# EAGLE design main (EAGLE 9.0.1)
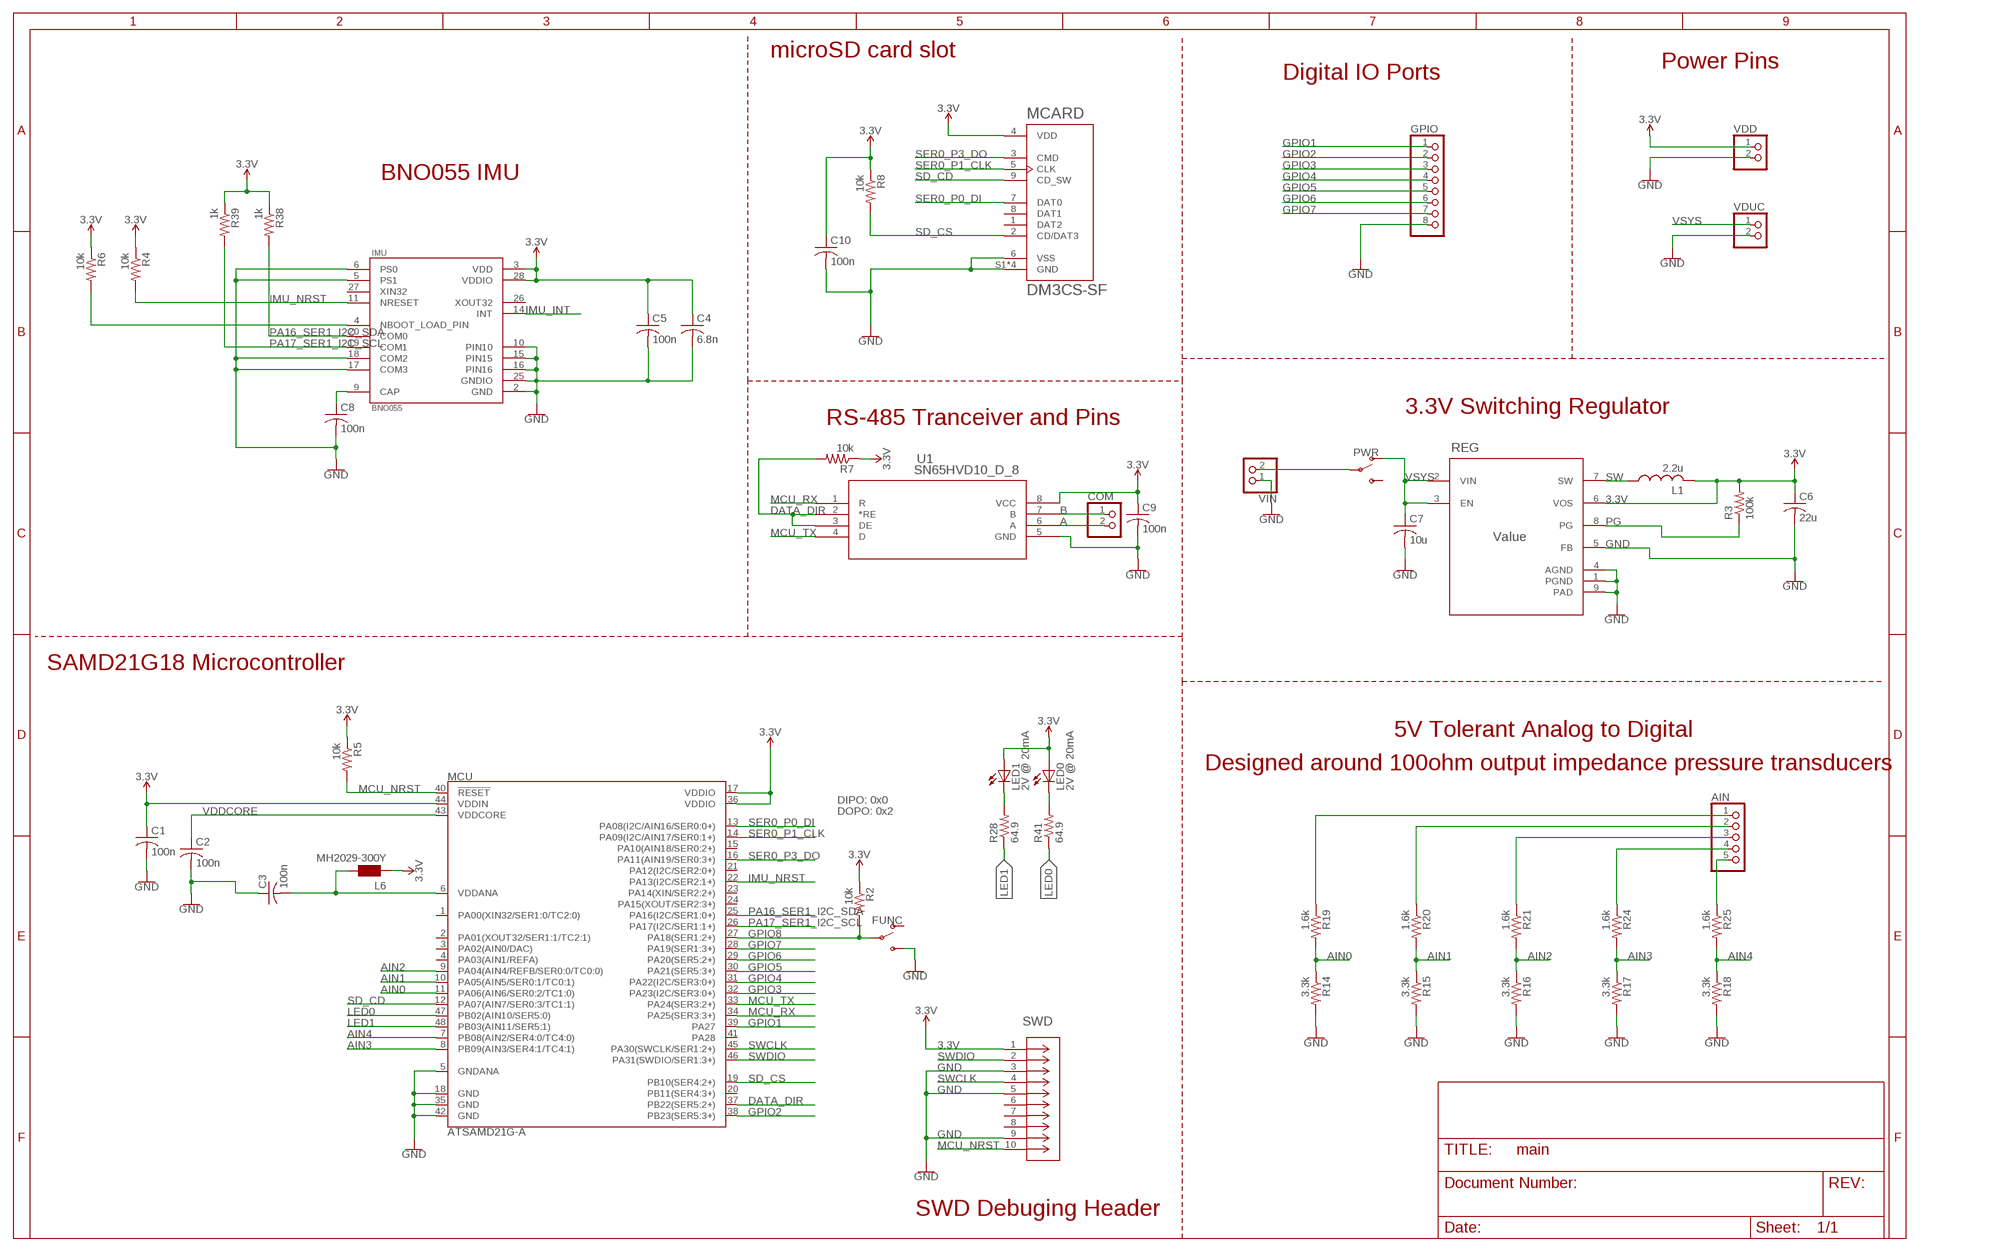
[diagram p0: schematic, sheet 1]

## Parts
AIN  PINHD-1X5  [1X05]
C1  100n  C-USC0603  [C0603]
C2  100n  C-USC0603  [C0603]
C3  100n  C-USC0603  [C0603]
C4  6.8n  C-USC0603  [C0603]
C5  100n  C-USC0603  [C0603]
C6  22u  C-USC0603  [C0603]
C7  10u  C-USC0603  [C0603]
C8  100n  C-USC0603  [C0603]
C9  100n  C-USC0603  [C0603]
C10  100n  C-USC0603  [C0603]
COM  PINHD-1X2  [1X02]
FUNC  SWITCH-SPDT-SMD-AYZ0202  [SWITCH_DPDT_SMD_AYZ0202]
GPIO  PINHD-1X8  [1X08]
IMU  BNO055  [LGA28R50P4X10_380X520X100]
L1  2.2u  L-USL2012C  [L2012C]
L6  MH2029-300Y  0001_BLM21PG300SN1D_/_MH2029-300Y  [0805]
LED0  2V @ 20mA  LEDCHIPLED_0603  [CHIPLED_0603]
LED1  2V @ 20mA  LEDCHIPLED_0603  [CHIPLED_0603]
MCARD  DM3CS-SF  [HRS_DM3CS-SF]
MCU  ATSAMD21G-A  [TQFP-48]
PWR  SWITCH-SPDT-PTH-11.6X4.0MM  [SWITCH_SPDT_PTH_11.6X4.0MM]
R2  10k  R-US_R0603  [R0603]
R3  100k  R-US_R0603  [R0603]
R4  10k  R-US_R0603  [R0603]
R5  10k  R-US_R0603  [R0603]
R6  10k  R-US_R0603  [R0603]
R7  10k  R-US_R0603  [R0603]
R8  10k  R-US_R0603  [R0603]
R14  3.3k  R-US_R0603  [R0603]
R15  3.3k  R-US_R0603  [R0603]
R16  3.3k  R-US_R0603  [R0603]
R17  3.3k  R-US_R0603  [R0603]
R18  3.3k  R-US_R0603  [R0603]
R19  1.6k  R-US_R0603  [R0603]
R20  1.6k  R-US_R0603  [R0603]
R21  1.6k  R-US_R0603  [R0603]
R24  1.6k  R-US_R0603  [R0603]
R25  1.6k  R-US_R0603  [R0603]
R28  64.9  R-US_R0603  [R0603]
R38  1k  R-US_R0603  [R0603]
R39  1k  R-US_R0603  [R0603]
R41  64.9  R-US_R0603  [R0603]
REG  Value  TPS62162QDSGRQ1  [DSG0008A]
SWD  DEBUG-HEADER  [CONN_MINITEK_2X5_HDR]
U1  SN65HVD10_D_8  [D8]
VDD  PINHD-1X2  [1X02]
VDUC  PINHD-1X2  [1X02]
VIN  PINHD-1X2  [1X02]

## Nets
3.3V: C1.1 C4.1 C5.1 C6.1 C9.1 C10.1 IMU.3(VDD) IMU.28(VDDIO) L1.2 L6.1 LED0.A LED1.A MCARD.4(VDD) MCU.17(VDDIO) MCU.36(VDDIO) MCU.44(VDDIN) R2.1 R3.2 R4.1 R5.1 R6.1 R7.1 R8.1 R38.1 R39.1 REG.6(VOS) SWD.1 U1.8(VCC) VDD.1
A: COM.2 U1.6(A)
AIN0: MCU.11(PA06(AIN6/SER0:2/TC1:0)) R14.1 R19.2
AIN1: MCU.10(PA05(AIN5/SER0:1/TC0:1)) R15.1 R20.2
AIN2: MCU.9(PA04(AIN4/REFB/SER0:0/TC0:0)) R16.1 R21.2
AIN3: MCU.8(PB09(AIN3/SER4:1/TC4:1)) R17.1 R24.2
AIN4: MCU.7(PB08(AIN2/SER4:0/TC4:0)) R18.1 R25.2
B: COM.1 U1.7(B)
DATA_DIR: MCU.37(PB22(SER5:2+)) R7.2 U1.2(*RE) U1.3(DE)
GND: C1.2 C2.2 C3.1 C4.2 C5.2 C6.2 C7.2 C8.2 C9.2 C10.2 FUNC.3(S) GPIO.8 IMU.2(GND) IMU.5(PS1) IMU.6(PS0) IMU.10(PIN10) IMU.15(PIN15) IMU.16(PIN16) IMU.17(COM3) IMU.18(COM2) IMU.25(GNDIO) MCARD.6(VSS) MCARD.S1(GND) MCARD.S2(GND) MCARD.S3(GND) MCARD.S5(GND) MCU.5(GNDANA) MCU.18(GND) MCU.35(GND) MCU.42(GND) R14.2 R15.2 R16.2 R17.2 R18.2 REG.1(PGND) REG.4(AGND) REG.5(FB) REG.9(PAD) SWD.3 SWD.5 SWD.9 U1.5(GND) VDD.2 VDUC.2 VIN.1
GPIO1: GPIO.1 MCU.39(PA27)
GPIO2: GPIO.2 MCU.38(PB23(SER5:3+))
GPIO3: GPIO.3 MCU.32(PA23(I2C/SER3:0+))
GPIO4: GPIO.4 MCU.31(PA22(I2C/SER3:0+))
GPIO5: GPIO.5 MCU.30(PA21(SER5:3+))
GPIO6: GPIO.6 MCU.29(PA20(SER5:2+))
GPIO7: GPIO.7 MCU.28(PA19(SER1:3+))
GPIO8: FUNC.2(P) MCU.27(PA18(SER1:2+)) R2.2
IMU_INT: IMU.14(INT)
IMU_NRST: IMU.11(NRESET) MCU.22(PA13(I2C/SER2:1+)) R4.2
LED0: MCU.47(PB02(AIN10/SER5:0)) R41.1
LED1: MCU.48(PB03(AIN11/SER5:1)) R28.1
MCU_NRST: MCU.40(!RESET!) R5.2 SWD.10
MCU_RX: MCU.34(PA25(SER3:3+)) U1.1(R)
MCU_TX: MCU.33(PA24(SER3:2+)) U1.4(D)
N$1: AIN.2 R20.1
N$2: C3.2 L6.2 MCU.6(VDDANA)
N$3: AIN.3 R21.1
N$4: AIN.4 R24.1
N$5: AIN.5 R25.1
N$7: LED0.C R41.2
N$8: AIN.1 R19.1
N$9: PWR.2(P) VIN.2
N$15: C8.1 IMU.9(CAP)
N$18: IMU.4(NBOOT_LOAD_PIN) R6.2
N$20: LED1.C R28.2
PA16_SER1_I2C_SDA: IMU.20(COM0) MCU.25(PA16(I2C/SER1:0+)) R38.2
PA17_SER1_I2C_SCL: IMU.19(COM1) MCU.26(PA17(I2C/SER1:1+)) R39.2
PG: R3.1 REG.8(PG)
SD_CD: MCARD.9(CD_SW) MCU.12(PA07(AIN7/SER0:3/TC1:1))
SD_CS: MCARD.2(CD/DAT3) MCU.19(PB10(SER4:2+)) R8.2
SER0_P0_DI: MCARD.7(DAT0) MCU.13(PA08(I2C/AIN16/SER0:0+))
SER0_P1_CLK: MCARD.5(CLK) MCU.14(PA09(I2C/AIN17/SER0:1+))
SER0_P3_DO: MCARD.3(CMD) MCU.16(PA11(AIN19/SER0:3+))
SW: L1.1 REG.7(SW)
SWCLK: MCU.45(PA30(SWCLK/SER1:2+)) SWD.4
SWDIO: MCU.46(PA31(SWDIO/SER1:3+)) SWD.2
VDDCORE: C2.1 MCU.43(VDDCORE)
VSYS: C7.1 PWR.1(O) REG.2(VIN) REG.3(EN) VDUC.1
Unconnected: FUNC.1(O) IMU.26(XOUT32) IMU.27(XIN32) MCARD.1(DAT2) MCARD.8(DAT1) MCU.1(PA00(XIN32/SER1:0/TC2:0)) MCU.2(PA01(XOUT32/SER1:1/TC2:1)) MCU.3(PA02(AIN0/DAC)) MCU.4(PA03(AIN1/REFA)) MCU.15(PA10(AIN18/SER0:2+)) MCU.20(PB11(SER4:3+)) MCU.21(PA12(I2C/SER2:0+)) MCU.23(PA14(XIN/SER2:2+)) MCU.24(PA15(XOUT/SER2:3+)) MCU.41(PA28) PWR.3(S) SWD.6 SWD.7 SWD.8

## Notes on the sheet
- microSD card slot
- Power Pins
- Digital IO Ports
- BNO055 IMU
- 3.3V Switching Regulator
- RS-485 Tranceiver and Pins
- SAMD21G18 Microcontroller
- 5V Tolerant Analog to Digital
- Designed around 100ohm output impedance pressure transducers
- DIPO: 0x0
- DOPO: 0x2
- SWD Debuging Header

## Library data of the parts
AIN = pinhead:PINHD-1X5: PIN HEADER
C1-C10 = resistor:C-US: CAPACITOR, American symbol
COM VDD VDUC VIN = pinhead:PINHD-1X2: PIN HEADER
FUNC = SparkFun-Switches:SWITCH-SPDT: Single Pole, Double Throw (SPDT) Switch Single-pole, double-throw (SPDT) switch. Variant Overview SMD-AYZ0202 Surface Mount DPDT Switch <https://www.sparkfun.com/products/597> (COM-00597) Used on e.g. LilyPad Arduino USB - ATmega32U4 Board <https://www.sparkfun.com/products/12049> PTH-11.6X4.0MM SPDT Mini Power Switch <https://www.sparkfun.com/products/102> (COM-00102) Used on e.g. SparkFun Simon Says - Through-Hole Soldering Kit <https://www.sparkfun.com/products/10547> (KIT-10547) PTH-11.6X4.0MM-KIT KIT version of SPDT Mini Power Switch - Simplifies soldering by removing tStop of switch pins - only one side can be soldered. PTH-11.6X4.0MM-LOCK LOCK version of SPDT Mini Power Switch - Offset pins hold switch in place for easier soldering. SMD-RIGHT-ANGLE Surface Mount Right Angle Switch <https://www.sparkfun.com/products/10860> (COM-10860) Used on e.g. SparkFun ESP8266 Thing <https://www.sparkfun.com/products/13231>; PROD_ID: SWCH-08179; SF_ID: COM-00597
GPIO = pinhead:PINHD-1X8: PIN HEADER
IMU = BNO055:BNO055: BNO055 9-axis Absolute Orientation Sensor ( SiP ) w/Sensors and Sensor Fusion; AVAILABILITY: Good; DESCRIPTION: IMU ACCEL/GYRO/MAG I2C 28LGA; MF: Bosch; MP: BNO055; PACKAGE: LGA-28 Bosch; PRICE: 7.78 USD
L1 = resistor:L-US: INDUCTOR, American symbol
L6 = Protezione:0001_BLM21PG300SN1D_/_MH2029-300Y: BLM21; MONTHLY_USAGE: _____; PART_NUMBER: BLM21PG300SN1D_/_MH2029-300Y; PRICE: _____; SUPPLIER: _____; TYPE: Protezione
LED0 LED1 = adafruit:LED: LED OSRAM: - CHIPLED LG R971, LG N971, LY N971, LG Q971, LY Q971, LO R971, LY R971 LH N974, LH R974 LS Q976, LO Q976, LY Q976 LO Q996 - Hyper CHIPLED LW Q18S LB Q993, LB Q99A, LB R99A - SideLED LS A670, LO A670, LY A670, LG A670, LP A670 LB A673, LV A673, LT A673, LW A673 LH A674 LY A675 LS A676, LA A676, LO A676, LY A676, LW A676 LS A679, LY A679, LG A679 - Hyper Micro SIDELED® LS Y876, LA Y876, LO Y876, LY Y876 LT Y87S - SmartLED LW L88C, LW L88S LB L89C, LB L89S, LG L890 LS L89K, LO L89K, LY L89K LS L896, LA L896, LO L896, LY L896 - TOPLED LS T670, LO T670, LY T670, LG T670, LP T670 LSG T670, LSP T670, LSY T670, LOP T670, LYG T670 LG T671, LOG T671, LSG T671 LB T673, LV T673, LT T673, LW T673 LH T674 LS T676, LA T676, LO T676, LY T676, LB T676, LH T676, LSB T676, LW T676 LB T67C, LV T67C, LT T67C, LS T67K, LO T67K, LY T67K, LW E67C LS E67B, LA E67B, LO E67B, LY E67B, LB E67C, LV E67C, LT E67C LW T67C LS T679, LY T679, LG T679 LS T770, LO T770, LY T770, LG T770, LP T770 LB T773, LV T773, LT T773, LW T773 LH T774 LS E675, LA E675, LY E675, LS T675 LS T776, LA T776, LO T776, LY T776, LB T776 LHGB T686 LT T68C, LB T68C - Hyper Mini TOPLED® LB M676 - Mini TOPLED Santana® LG M470 LS M47K, LO M47K, LY M47K Source: http://www.osram.convergy.de/
MCARD = DM3CS-SF:DM3CS-SF: CONN MICRO SD CARD HINGED TYPE; DESCRIPTION: Conn Micro SD Card HDR 8 POS 1.1mm Solder RA SMD Embossed T/R 0.5A; DIGI-KEY_PART_NUMBER: HR1972CT-ND; DIGI-KEY_PURCHASE_URL: https://www.digikey.com/product-detail/en/hirose-electric-co-ltd/DM3CS-SF/HR1972CT-ND/2602740?utm_source=snapeda&utm_medium=aggregator&utm_campaign=symbol; MF: Hirose; MP: DM3CS-SF; PACKAGE: None
MCU = SparkFun-IC-Microcontroller:ATSAMD21G: Atmel SAMD21G SMART ARM-Based Microcontroller The Atmel ® | SMART ™ SAM D21 is a series of low-power microcontrollers using the 32-bit ARM ® Cortex ® -M0+ processor, and ranging from 32- to 64-pins with up to 256KB Flash and 32KB of SRAM. The SAM D21 devices operate at a maximum frequency of 48MHz and reach 2.46 CoreMark/MHz. They are designed for simple and intuitive migration with identical peripheral modules, hex compatible code, identical linear address map and pin compatible migration paths between all devices in the product series. All devices include intelligent and flexible peripherals, Atmel Event System for inter-peripheral signaling, and support for capacitive touch button, slider and wheel user interfaces. Datasheet <https://cdn.sparkfun.com/datasheets/Dev/Arduino/Boards/Atmel-42181-SAM-D21_Datasheet.pdf> SparkFun Products SparkFun SAMD21 Mini Breakout <https://www.sparkfun.com/products/13664> (DEV-13664) SparkFun SAMD21 Dev Breakout <https://www.sparkfun.com/products/13672> (DEV-13672); PROD_ID: IC-13064
PWR = SparkFun-Switches:SWITCH-SPDT: Single Pole, Double Throw (SPDT) Switch Single-pole, double-throw (SPDT) switch. Variant Overview SMD-AYZ0202 Surface Mount DPDT Switch <https://www.sparkfun.com/products/597> (COM-00597) Used on e.g. LilyPad Arduino USB - ATmega32U4 Board <https://www.sparkfun.com/products/12049> PTH-11.6X4.0MM SPDT Mini Power Switch <https://www.sparkfun.com/products/102> (COM-00102) Used on e.g. SparkFun Simon Says - Through-Hole Soldering Kit <https://www.sparkfun.com/products/10547> (KIT-10547) PTH-11.6X4.0MM-KIT KIT version of SPDT Mini Power Switch - Simplifies soldering by removing tStop of switch pins - only one side can be soldered. PTH-11.6X4.0MM-LOCK LOCK version of SPDT Mini Power Switch - Offset pins hold switch in place for easier soldering. SMD-RIGHT-ANGLE Surface Mount Right Angle Switch <https://www.sparkfun.com/products/10860> (COM-10860) Used on e.g. SparkFun ESP8266 Thing <https://www.sparkfun.com/products/13231>; PROD_ID: SWCH-08261; SF_SKU: COM-00102
R2-R8 R14-R21 R24 R25 R28 R38 R39 R41 = resistor:R-US_: RESISTOR, American symbol
REG = TPS62162-Q1:TPS62162QDSGRQ1; MANUFACTURER: Texas Instruments; PARTNUMBER: TPS62162QDSGRQ1; REFDES: RefDes; TYPE: TYPE
SWD = senior-design-custom:DEBUG-HEADER; MANUFACTURER_PART_NUMBER: 2002111100010T4LF; VENDOR: FCI
U1 = half-dup-485:SN65HVD10_D_8; DATASHEETURL: httpwww.ti.comlitgpnSN65HVD10; FAMILY_NAME: RS485; GENERIC_PART_NUMBER: SN65HVD10; INDUSTRY_STD_PKG_TYPE: SOIC; MANUFACTURER: Texas Instruments; MANUFACTURER_PART_NUMBER: sn65hvd10_d_8; PACKAGE_DESIGNATOR: D; PIN_COUNT: 8; VENDOR: Texas Instruments

## Board
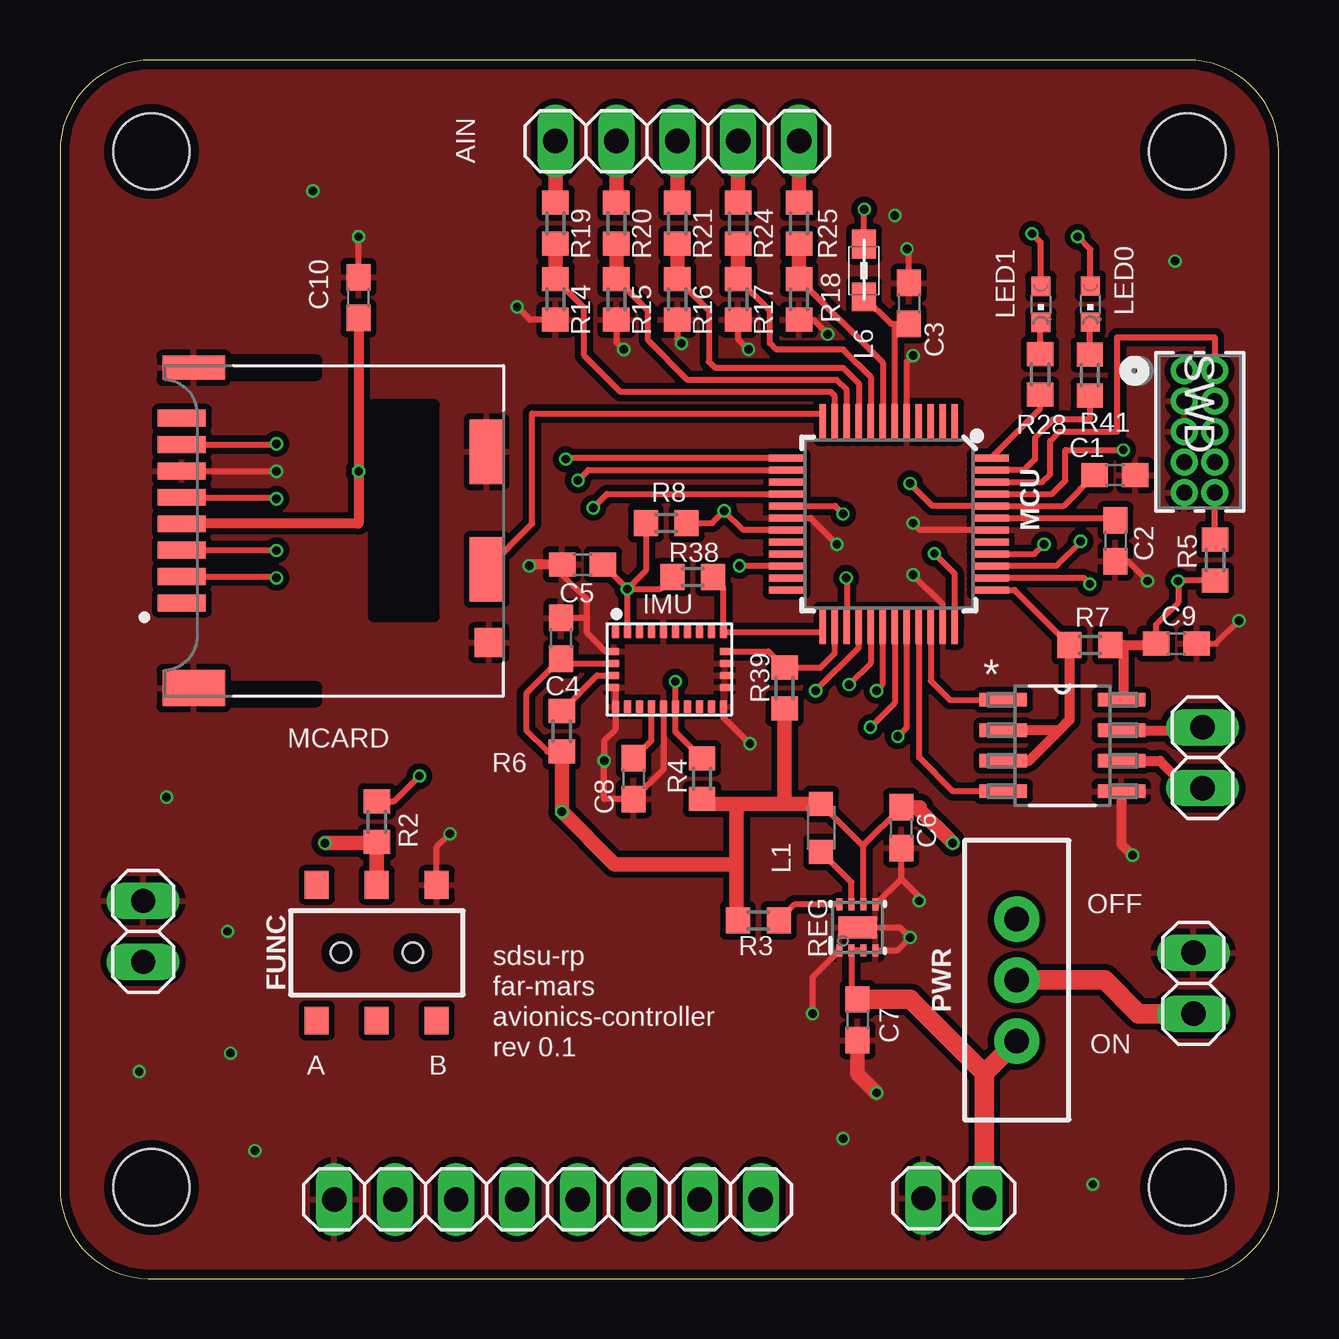
[diagram p1: board, top side]
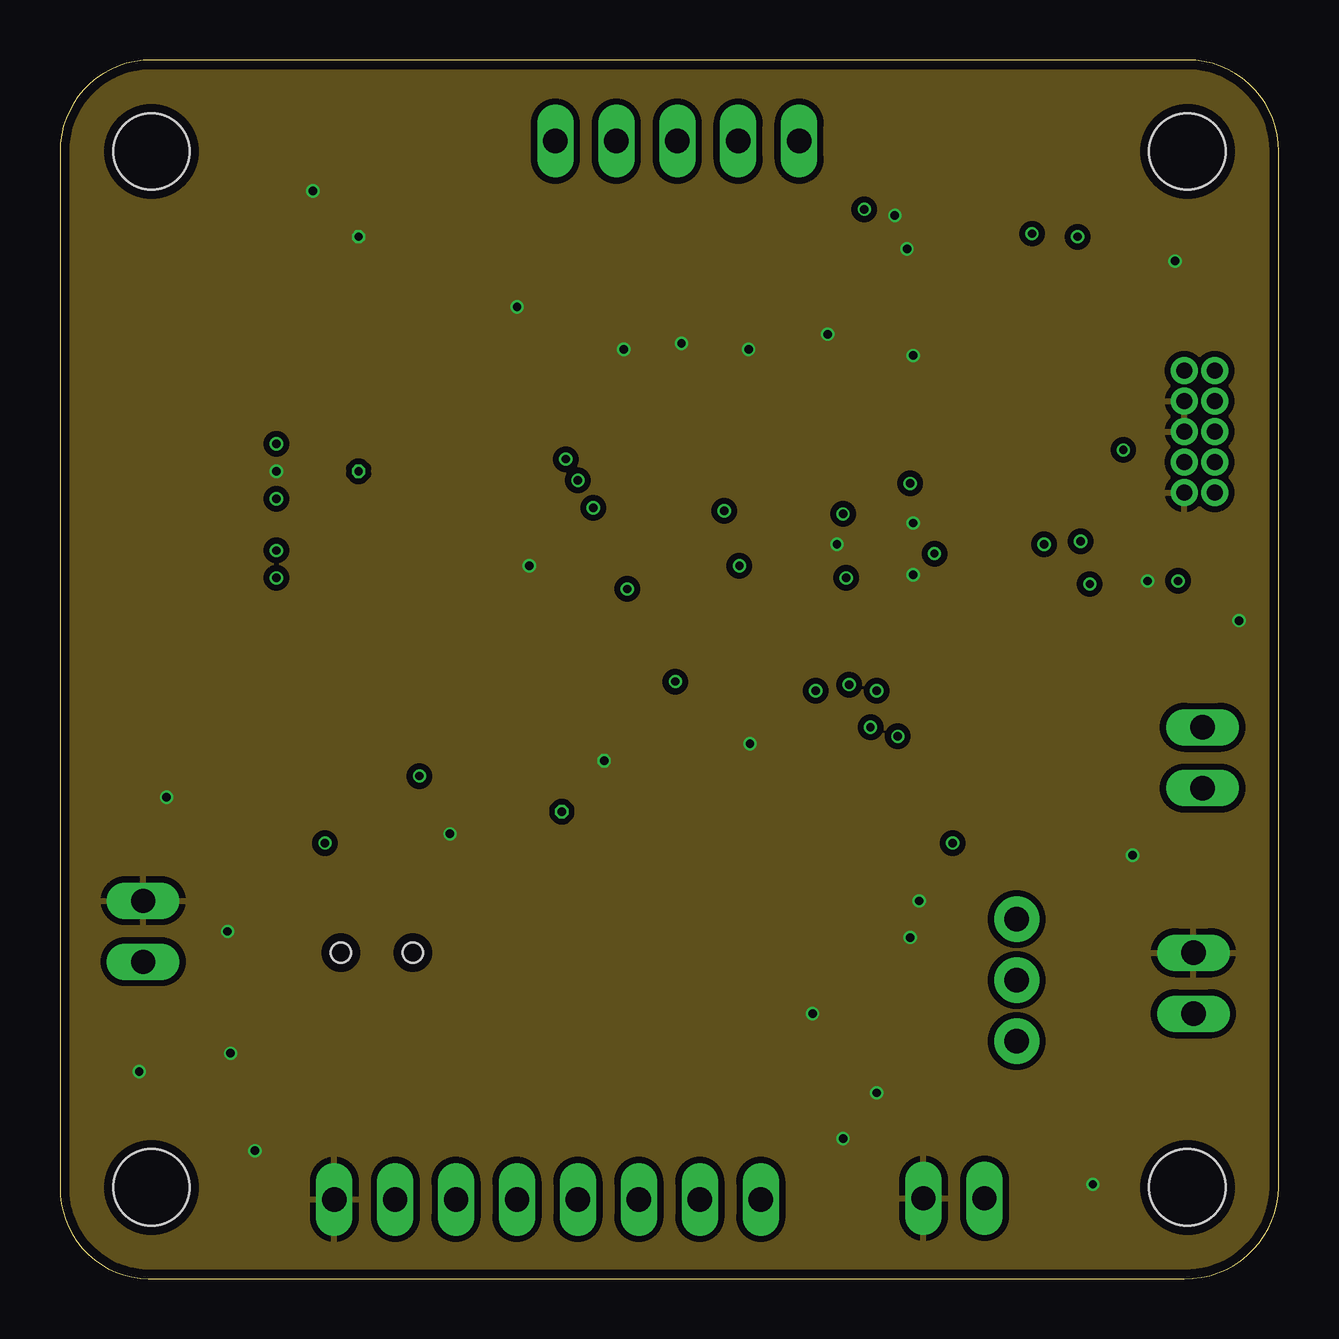
[diagram p2: board, inner layer Route2]
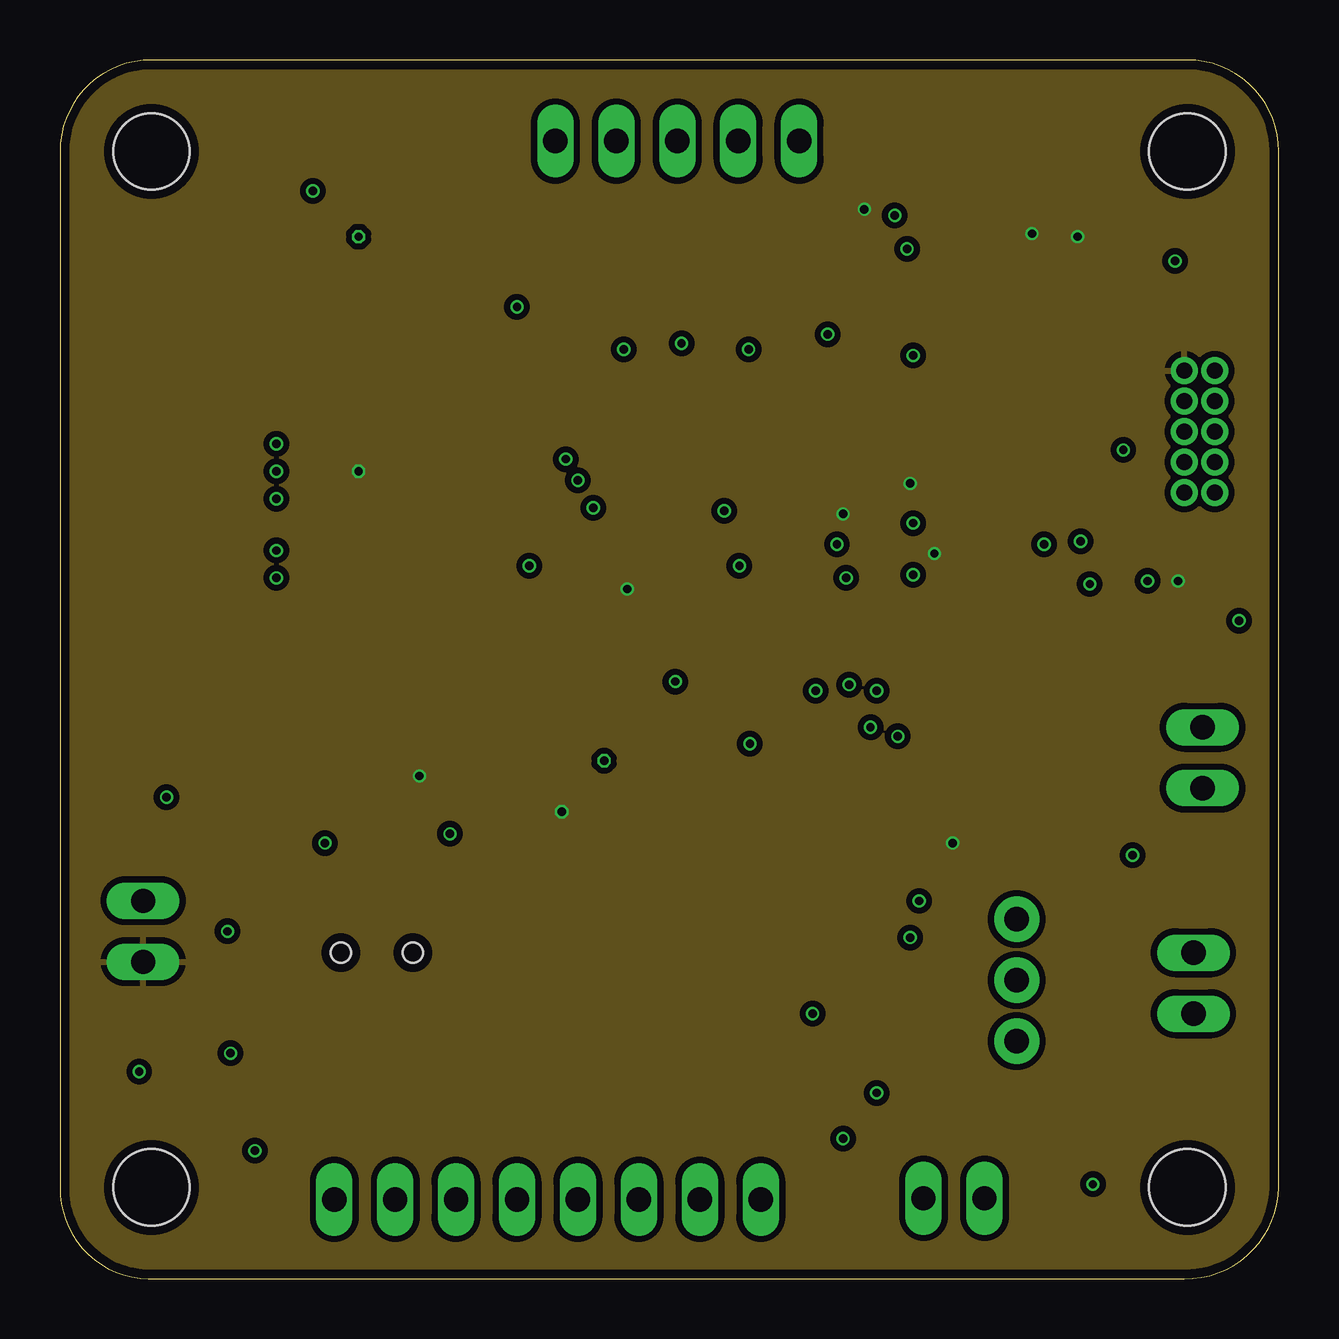
[diagram p3: board, inner layer Route15]
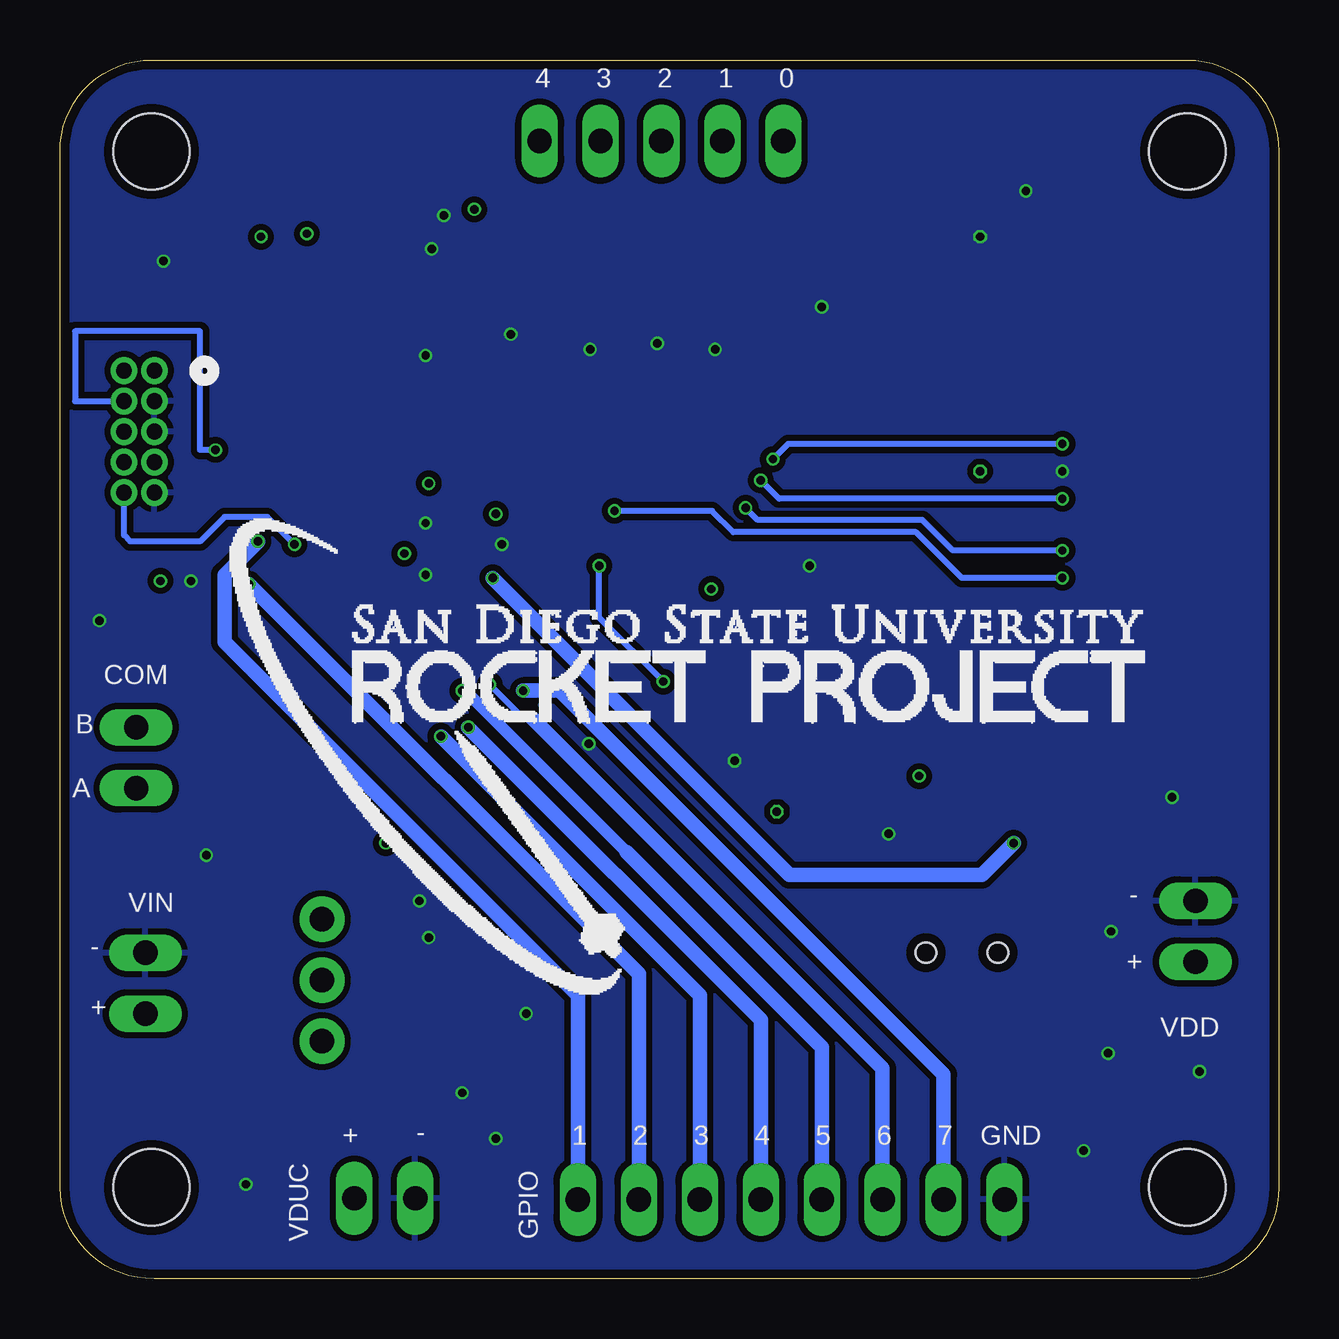
[diagram p4: board, bottom side, seen from below]

Size 50.8 x 50.8 mm. Coordinates in mm from the lower left corner, seen from the top.
Outline: 0,46.99 0,3.81 arc90 3.68,0 46.86,0 arc90 50.8,3.81 50.8,46.99 arc90 46.99,50.8 3.81,50.8 arc90 0,46.99
Copper layers (1*2*15*16): Top 0.035559375mm / dielectric 0.17018125mm / Route2 0.01778125mm / dielectric 47mil / Route15 0.01778125mm / dielectric 0.17018125mm / Bottom 0.035559375mm
Design rules "oshpark-4layer": minimum track width 5mil, minimum drill 10mil, track to track 5mil, track to pad 5mil, pad to pad 5mil, via to via 5mil, smd to smd 5mil, copper to edge 15mil, drill to drill 6mil, minimum pad ring 4mil, minimum via ring 4mil, stop-mask expansion 2.5mil, vias tented up to drill 0mil, thermal gap 10mil

### Footprints (pad centres in the part's own frame; a part is rotated, then mirrored left to right if it is on the bottom)
1X05 = drill 1.016 long: 1 -5.08,0; 2 -2.54,0; 3 0,0; 4 2.54,0; 5 5.08,0
C0603 = smd 1.1 x 1: 1 -0.85,0; 2 0.85,0
1X02 = drill 1.016 long: 1 -1.27,0; 2 1.27,0
SWITCH_DPDT_SMD_AYZ0202 = smd 1 x 1.15: 1 -2.5,2.825; 2 0,2.825; 3 2.5,2.825; 4 -2.5,-2.825; 5 0,-2.825; 6 2.5,-2.825 | hole 0.85: 1.5,0; -1.5,0
1X08 = drill 1.016 long: 1 -8.89,0; 2 -6.35,0; 3 -3.81,0; 4 -1.27,0; 5 1.27,0; 6 3.81,0; 7 6.35,0; 8 8.89,0
LGA28R50P4X10_380X520X100 = smd 0.3 x 0.525: 1 -2.25,1.562; 6 -2.25,-1.562; 7 -1.75,-1.562; 8 -1.25,-1.562; 9 -0.75,-1.562; 10 -0.25,-1.562; 11 0.25,-1.562; 12 0.75,-1.562; 13 1.25,-1.562; 14 1.75,-1.562; 15 2.25,-1.562; 20 2.25,1.562; 21 1.75,1.562; 22 1.25,1.562; 23 0.75,1.562; 24 0.25,1.562; 25 -0.25,1.562; 26 -0.75,1.562; 27 -1.25,1.562; 28 -1.75,1.562 | smd 0.425 x 0.3: 2 -2.312,0.75; 3 -2.312,0.25; 4 -2.312,-0.25; 5 -2.312,-0.75; 16 2.312,-0.75; 17 2.312,-0.25; 18 2.312,0.25; 19 2.312,0.75
L2012C = smd 1 x 1: 1 -1,0; 2 1,0
0805 = smd 1.2 x 1: 1 -1.1,0; 2 1.1,0
CHIPLED_0603 = smd 0.8 x 0.8: A 0,-0.75; C 0,0.75
HRS_DM3CS-SF = smd 0.7 x 2: 1 3.2,-6.35; 2 2.1,-6.35; 3 1,-6.35; 4 -0.1,-6.35; 5 -1.2,-6.35; 6 -2.3,-6.35; 7 -3.4,-6.35; 8 -4.5,-6.35 | smd 2.7 x 1.4: 9 1.8,6.35; S3 -3.1,6.35 | smd 1 x 2.6: S1 -6.6,-5.85 | smd 1.5 x 2.6: S2 6.75,-5.85 | smd 1.2 x 1.2: S5 4.85,6.45
TQFP-48 = smd 1.5 x 0.28: 1 -4.25,2.75; 2 -4.25,2.25; 3 -4.25,1.75; 4 -4.25,1.25; 5 -4.25,0.75; 6 -4.25,0.25; 7 -4.25,-0.25; 8 -4.25,-0.75; 9 -4.25,-1.25; 10 -4.25,-1.75; 11 -4.25,-2.25; 12 -4.25,-2.75; 25 4.25,-2.75; 26 4.25,-2.25; 27 4.25,-1.75; 28 4.25,-1.25; 29 4.25,-0.75; 30 4.25,-0.25; 31 4.25,0.25; 32 4.25,0.75; 33 4.25,1.25; 34 4.25,1.75; 35 4.25,2.25; 36 4.25,2.75 | smd 0.28 x 1.5: 13 -2.75,-4.25; 14 -2.25,-4.25; 15 -1.75,-4.25; 16 -1.25,-4.25; 17 -0.75,-4.25; 18 -0.25,-4.25; 19 0.25,-4.25; 20 0.75,-4.25; 21 1.25,-4.25; 22 1.75,-4.25; 23 2.25,-4.25; 24 2.75,-4.25; 37 2.75,4.25; 38 2.25,4.25; 39 1.75,4.25; 40 1.25,4.25; 41 0.75,4.25; 42 0.25,4.25; 43 -0.25,4.25; 44 -0.75,4.25; 45 -1.25,4.25; 46 -1.75,4.25; 47 -2.25,4.25; 48 -2.75,4.25
SWITCH_SPDT_PTH_11.6X4.0MM = drill 1.016 pad 1.88: 1 0,2.54; 2 0,0; 3 0,-2.54
R0603 = smd 1 x 1.1: 1 -0.85,0; 2 0.85,0
DSG0008A = smd 0.5 x 0.25: 1 -0.95,0.75; 2 -0.95,0.25; 3 -0.95,-0.25; 4 -0.95,-0.75; 5 0.95,-0.75; 6 0.95,-0.25; 7 0.95,0.25; 8 0.95,0.75 | smd 0.9 x 1.6: 9 0,0 | smd 0.5 x 0.5: V 0,-0.4
CONN_MINITEK_2X5_HDR = drill 0.66 pad 1.118: 1 -2.54,-0.635; 2 -2.54,0.635; 3 -1.27,-0.635; 4 -1.27,0.635; 5 0,-0.635; 6 0,0.635; 7 1.27,-0.635; 8 1.27,0.635; 9 2.54,-0.635; 10 2.54,0.635
D8 = smd 1.981 x 0.559: 1 -2.464,1.905; 2 -2.464,0.635; 3 -2.464,-0.635; 4 -2.464,-1.905; 5 2.464,-1.905; 6 2.464,-0.635; 7 2.464,0.635; 8 2.464,1.905
DRILL_0.1250 = hole 3.175: 0,0

### Placement (x,y rotation side)
AIN  25.73,47.42 0 top
C1  43.97,33.49 0 top
C2  43.99,30.76 270 top
C3  35.38,40.65 270 top
C4  20.89,26.7 90 top
C5  21.78,29.77 180 top
C6  35.06,18.8 270 top
C7  33.25,10.79 270 top
C8  23.91,20.84 270 top
C9  46.53,26.47 0 top
C10  12.45,40.89 90 top
COM  47.62,21.72 270 top
FUNC  13.21,13.59 0 top
GPIO  20.32,3.3 180 top
IMU  25.4,25.4 0 top
L1  31.72,18.8 90 top
L6  33.52,42.02 270 top
LED0  42.95,40.63 180 top
LED1  40.88,40.61 180 top
MCARD  11.43,31.37 270 top
MCU  34.54,31.46 270 top
PWR  39.88,12.45 180 top
R2  13.21,19.05 270 top
R3  29.11,14.94 180 top
R4  26.76,20.84 90 top
R5  48.15,29.96 90 top
R6  20.92,22.82 90 top
R7  42.93,26.42 180 top
R8  25.27,31.5 0 top
R14  20.65,40.82 270 top
R15  23.19,40.82 270 top
R16  25.73,40.82 270 top
R17  28.27,40.82 270 top
R18  30.81,40.82 270 top
R19  20.65,43.99 270 top
R20  23.19,43.99 270 top
R21  25.73,43.99 270 top
R24  28.27,43.99 270 top
R25  30.81,43.99 270 top
R28  40.86,37.69 90 top
R38  26.38,29.25 0 top
R39  30.2,24.63 90 top
R41  42.93,37.67 90 top
REG  33.25,14.64 90 top
SWD  47.5,35.31 270 top
U1  41.78,22.23 0 top
U$1  [DRILL_0.1250]  3.81,3.81 0 top
U$2  [DRILL_0.1250]  3.81,46.99 0 top
U$3  [DRILL_0.1250]  46.99,3.81 0 top
U$4  [DRILL_0.1250]  46.99,46.99 0 top
U$5  [RP-LOGO-DPIFIX]  43.69,11.81 0 bottom
VDD  3.47,14.48 90 top
VDUC  37.26,3.35 180 top
VIN  47.24,12.32 270 top

### Tracks (layer width: path | path; a pad name or v marks a point on that pad's centre or on a via)
3.3V  (via drill 0.35)
  Top 0.254: IMU.28 v23.65,28.75 | v23.65,28.75 C5.1 | REG.6 33.5,18.02 | 33.5,18.02 33.5,18.08 C6.1 | 33.5,18.02 L1.2 | v23.65,28.75 25.03,28.75 R38.1 | C1.1 41.84,32.21 MCU.44 36.37,32.21 v35.43,33.15 | MCU.17 32.31,32.21 v32.64,31.88 | MCU.36 37.29,29.38 v36.45,30.23 | R2.1 13.93,19.9 v14.99,20.95 | R5.1 46.63,29.11 v46.61,29.08 46.61,28.19 45.68,27.27 C9.1 | L6.1 33.52,44.56 v33.53,44.58 | LED1.A 40.88,43.19 v40.51,43.56 | LED0.A 42.95,42.9 v42.42,43.43 | R8.1 24.42,29.52 v23.65,28.75 | IMU.3 21.09,25.65 C4.1 19.43,24.39 19.43,22.86 20.32,21.97 R6.1
  Top 0.406: R7.1 44.32,26.42 | 44.32,26.42 45.63,26.42 C9.1 | 44.32,26.42 44.32,24.21 U1.8 | MCARD.4 12.45,31.47 v12.45,33.66 C10.1
  Top 0.61: L1.2 30.23,19.8 | 30.23,19.8 28.19,19.8 | 28.19,19.8 26.95,19.8 R4.1 | R39.1 30.2,19.82 30.23,19.8 | 28.19,19.8 28.19,17.27 | 28.19,17.27 28.19,15 R3.2 | 35.85,19.65 C6.1 35.73,19.65 v37.21,18.16 | R6.1 v20.92,19.47 23.11,17.27 28.19,17.27
  pour Route15 (isolate 0.254): 0,0 50.8,0 50.8,50.8 0,50.8
A
  Top 0.406: U1.6 45.85,21.59 46.99,20.45 COM.2
AIN0
  Top 0.254: MCU.11 32.29,36.79 32.13,36.96 23.37,36.96 21.84,38.48 21.84,40.47 R14.1
  Top 0.61: R14.1 R19.2
AIN1
  Top 0.254: MCU.10 32.79,37.06 32.38,37.47 26.16,37.47 24.51,39.12 24.51,40.35 R15.1
  Top 0.61: R15.1 R20.2
AIN2
  Top 0.254: R16.1 27.05,40.35 27.05,38.23 27.3,37.97 32.64,37.97 33.29,37.32 MCU.9
  Top 0.61: R16.1 R21.2
AIN3
  Top 0.254: MCU.8 33.79,37.58 32.64,38.73 29.84,38.73 29.59,38.99 29.59,40.35 R17.1
  Top 0.61: R17.1 R24.2
AIN4
  Top 0.254: R18.1 34.29,38.18 MCU.7
  Top 0.61: R18.1 R25.2
B
  Top 0.406: U1.7 47.5,22.86 COM.1
DATA_DIR
  Top 0.254: MCU.37 39.78,28.71 R7.2
  Top 0.406: R7.2 42.08,23.28 41.66,22.86 | 41.66,22.86 U1.2 | U1.3 40.39,21.59 41.66,22.86
GND  (via drill 0.35)
  Top 0.254: REG.5 35.06,16.66 | 35.06,16.66 C6.2 | 27.65,24.65 IMU.16 | R14.2 19.59,39.97 v19.05,40.51 | R15.2 23.19,39.04 v23.5,38.73 | R16.2 25.73,39.17 v25.91,38.99 | R17.2 28.27,39.17 v28.7,38.73 | R18.2 31.41,39.97 v32,39.37 | MCU.18 31.28,31.71 v32.38,30.61 | MCU.35 36.79,28.1 v35.56,29.34 | MCU.42 35.85,31.21 v35.56,31.5 | C2.2 44.51,29.91 v45.34,29.08 | 35.06,16.66 35.81,15.91 v35.81,15.75 | REG.9 35.01,14.64 v35.43,14.22 34.9,13.69 REG.4 | REG.1 31.37,12.56 v31.37,11.05 | FUNC.3 15.71,17.99 v16.26,18.54 | IMU.15 27.65,23.4 v28.76,22.3 | IMU.10 25.15,21.23 C8.2 22.68,19.99 v22.68,21.59 22.68,22.43 23.15,22.9 IMU.6 23.15,24.59 IMU.5 | IMU.2 22.75,26.15 21.97,26.92 21.97,27.56 | 21.97,27.56 21.97,28.32 20.93,29.36 C5.2 | C9.2 48.18,26.47 v49.15,27.43 | C3.1 35.38,42.85 v35.31,42.93 | MCU.5 35.29,38.22 v35.56,38.48 | MCARD.6 9,33.67 v9.02,33.66 | 21.97,27.56 21.96,27.55 C4.2 | C10.2 v12.45,43.43
  Top 0.406: C5.2 19.61,29.77 v19.56,29.72 | U1.5 44.25,18.11 v44.7,17.65
  Top 0.61: C7.2 33.25,8.53 v34.04,7.75
  other vias: 7.11,9.4 6.99,14.48 4.45,20.07 3.3,8.64 8.13,5.33 32.64,5.84 43.05,3.94 10.54,45.34 34.8,44.32 46.48,42.42
  pour Bottom (isolate 0.254): 0,0 50.8,0 50.8,50.8 0,50.8
  pour Top (isolate 0.254): 0,0 50.8,0 50.8,50.8 0,50.8
  pour Route2 (isolate 0.254): 0,0 50.8,0 50.8,50.8 0,50.8
GPIO1  (via drill 0.35)
  Top 0.254: v42.55,30.73 41.52,29.71 MCU.39
  Bottom 0.61: GPIO.1 29.21,11.81 35.24,17.84 43.94,26.54 43.94,29.34 v42.55,30.73
GPIO2  (via drill 0.35)
  Top 0.254: v42.93,28.96 42.67,29.21 MCU.38
  Bottom 0.61: GPIO.2 26.67,12.7 v42.93,28.96
GPIO3  (via drill 0.35)
  Top 0.254: v34.92,22.61 35.29,22.98 MCU.32
  Bottom 0.61: GPIO.3 24.13,11.81 v34.92,22.61
GPIO4  (via drill 0.35)
  Top 0.254: MCU.31 34.79,24 v33.78,22.99
  Bottom 0.61: v33.78,22.99 21.59,10.79 GPIO.4
GPIO5  (via drill 0.35)
  Top 0.254: v34.04,24.51 34.29,24.77 MCU.30
  Bottom 0.508: 27.18,17.78 33.91,24.51 v34.04,24.51
  Bottom 0.61: GPIO.5 19.05,9.65 27.18,17.78
GPIO6  (via drill 0.35)
  Top 0.254: MCU.29 33.79,25.67 v32.89,24.77
  Bottom 0.254: v32.89,24.77 31.5,23.37 31.11,23.37
  Bottom 0.61: GPIO.6 16.51,8.76 31.11,23.37
GPIO7  (via drill 0.35)
  Top 0.254: v31.5,24.51 33.29,26.31 MCU.28
  Bottom 0.61: GPIO.7 13.97,8.51 29.97,24.51 v31.5,24.51
GPIO8  (via drill 0.35)
  Top 0.254: v32.77,29.21 32.79,29.18 MCU.27
  Top 0.61: v11.05,18.16 13.17,18.16 R2.2 FUNC.2
  Bottom 0.61: v32.77,29.21 20.38,16.83 12.38,16.83 v11.05,18.16
IMU_NRST  (via drill 0.35)
  Top 0.254: R4.2 25.65,22.8 IMU.11 v25.65,24.89 | v28.32,29.72 MCU.22
  Bottom 0.254: v25.65,24.89 28.32,27.56 v28.32,29.72
LED0
  Top 0.254: R41.1 42.93,35.81 41.4,35.81 40.64,35.05 40.64,34.16 40.19,33.71 MCU.47
LED1
  Top 0.254: MCU.48 40.86,36.27 R28.1
MCU_NRST  (via drill 0.35)
  Top 0.254: R5.2 48.15,32.75 SWD.10 | MCU.40 40.62,30.21 v41.02,30.61
  Bottom 0.254: v41.02,30.61 42.16,31.75 43.94,31.75 44.96,30.73 47.88,30.73 48.13,30.99 SWD.10
MCU_RX
  Top 0.254: MCU.34 36.29,24.92 37.08,24.13 U1.1
MCU_TX
  Top 0.254: MCU.33 35.81,27.19 35.81,21.72 37.21,20.32 U1.4
N$1
  Top 0.61: R20.1 AIN.2
N$2
  Top 0.254: L6.2 34.64,39.8 34.8,39.8 | 34.8,39.8 C3.2 | MCU.6 34.8,39.8
N$3
  Top 0.61: R21.1 AIN.3
N$4
  Top 0.61: R24.1 AIN.4
N$5
  Top 0.61: R25.1 AIN.5
N$7
  Top 0.254: R41.2 42.93,39.85 LED0.C
N$8
  Top 0.61: R19.1 AIN.1
N$9
  Top 0.813: VIN.2 44.96,11.05 43.56,12.45 PWR.2
N$15
  Top 0.254: C8.1 24.65,22.43 IMU.9
N$18
  Top 0.254: R6.2 22.39,25.15 IMU.4
N$20
  Top 0.254: R28.2 40.86,39.84 LED1.C
PA16_SER1_I2C_SDA
  Top 0.254: R38.2 27.65,28.83 IMU.20 31.79,26.96 MCU.25
PA17_SER1_I2C_SCL
  Top 0.254: 27.73,26.14 IMU.19 29.53,26.15 R39.2 31.7,25.48 32.29,26.07 MCU.26
PG
  Top 0.254: REG.8 30.62,15.59 R3.1
SD_CD
  Top 0.254: MCARD.9 19.68,31.47 19.68,36.07 31.79,36.07 MCU.12
SD_CS  (via drill 0.35)
  Top 0.254: MCARD.2 8.96,29.27 v9.02,29.21 | MCU.19 28.48,31.21 v27.69,32 27.18,31.5 R8.2
  Bottom 0.254: v9.02,29.21 13.21,29.21 15.11,31.11 22.73,31.11 23.62,32 v27.69,32
SER0_P0_DI  (via drill 0.35)
  Top 0.254: MCARD.7 8.99,34.77 v9.02,34.8 | MCU.13 21.13,34.21 v21.08,34.16
  Bottom 0.254: v9.02,34.8 20.45,34.8 v21.08,34.16
SER0_P1_CLK  (via drill 0.35)
  Top 0.254: MCARD.5 8.96,32.57 v9.02,32.51 | v21.59,33.27 22.02,33.71 MCU.14
  Bottom 0.254: v9.02,32.51 20.83,32.51 v21.59,33.27
SER0_P3_DO  (via drill 0.35)
  Top 0.254: MCARD.3 9,30.37 v9.02,30.35 | v22.23,32.13 22.8,32.71 MCU.16
  Bottom 0.254: v9.02,30.35 13.59,30.35 14.86,31.62 21.72,31.62 v22.23,32.13
SW
  Top 0.254: REG.7 33,16.52 L1.1
SWCLK  (via drill 0.35)
  Top 0.254: MCU.45 41.34,32.71 41.91,33.27 41.91,34.54 v44.32,34.54
  Bottom 0.254: v44.32,34.54 44.96,34.54 44.96,39.5 50.16,39.5 50.16,36.58 SWD.4
SWDIO
  Top 0.254: MCU.46 40.95,33.21 41.27,33.53 41.27,34.92 41.66,35.31 44.07,35.31 44.07,39.24 48.13,39.24 SWD.2
VDDCORE
  Top 0.254: MCU.43 43.89,31.71 C2.1
VSYS
  Top 0.254: 33.5,11.89 C7.1 33,11.89 REG.2 REG.3
  Top 0.813: PWR.1 38.53,8.56 | 38.53,8.56 VDUC.1 | C7.1 35.45,11.64 38.53,8.56

### Text on the board
tPlace: sdsu-rp | far-mars | avionics-controller | rev 0.1
tNames: OFF | A | B | ON
bNames: 0 | 1 | 2 | 3 | 4 | B | A | - | + | - | + | GND | 7 | 6 | 5 | 4 | 3 | 2 | 1 | - | +